# EAGLE schematic Automatic Changeover (EAGLE 9.6.2)
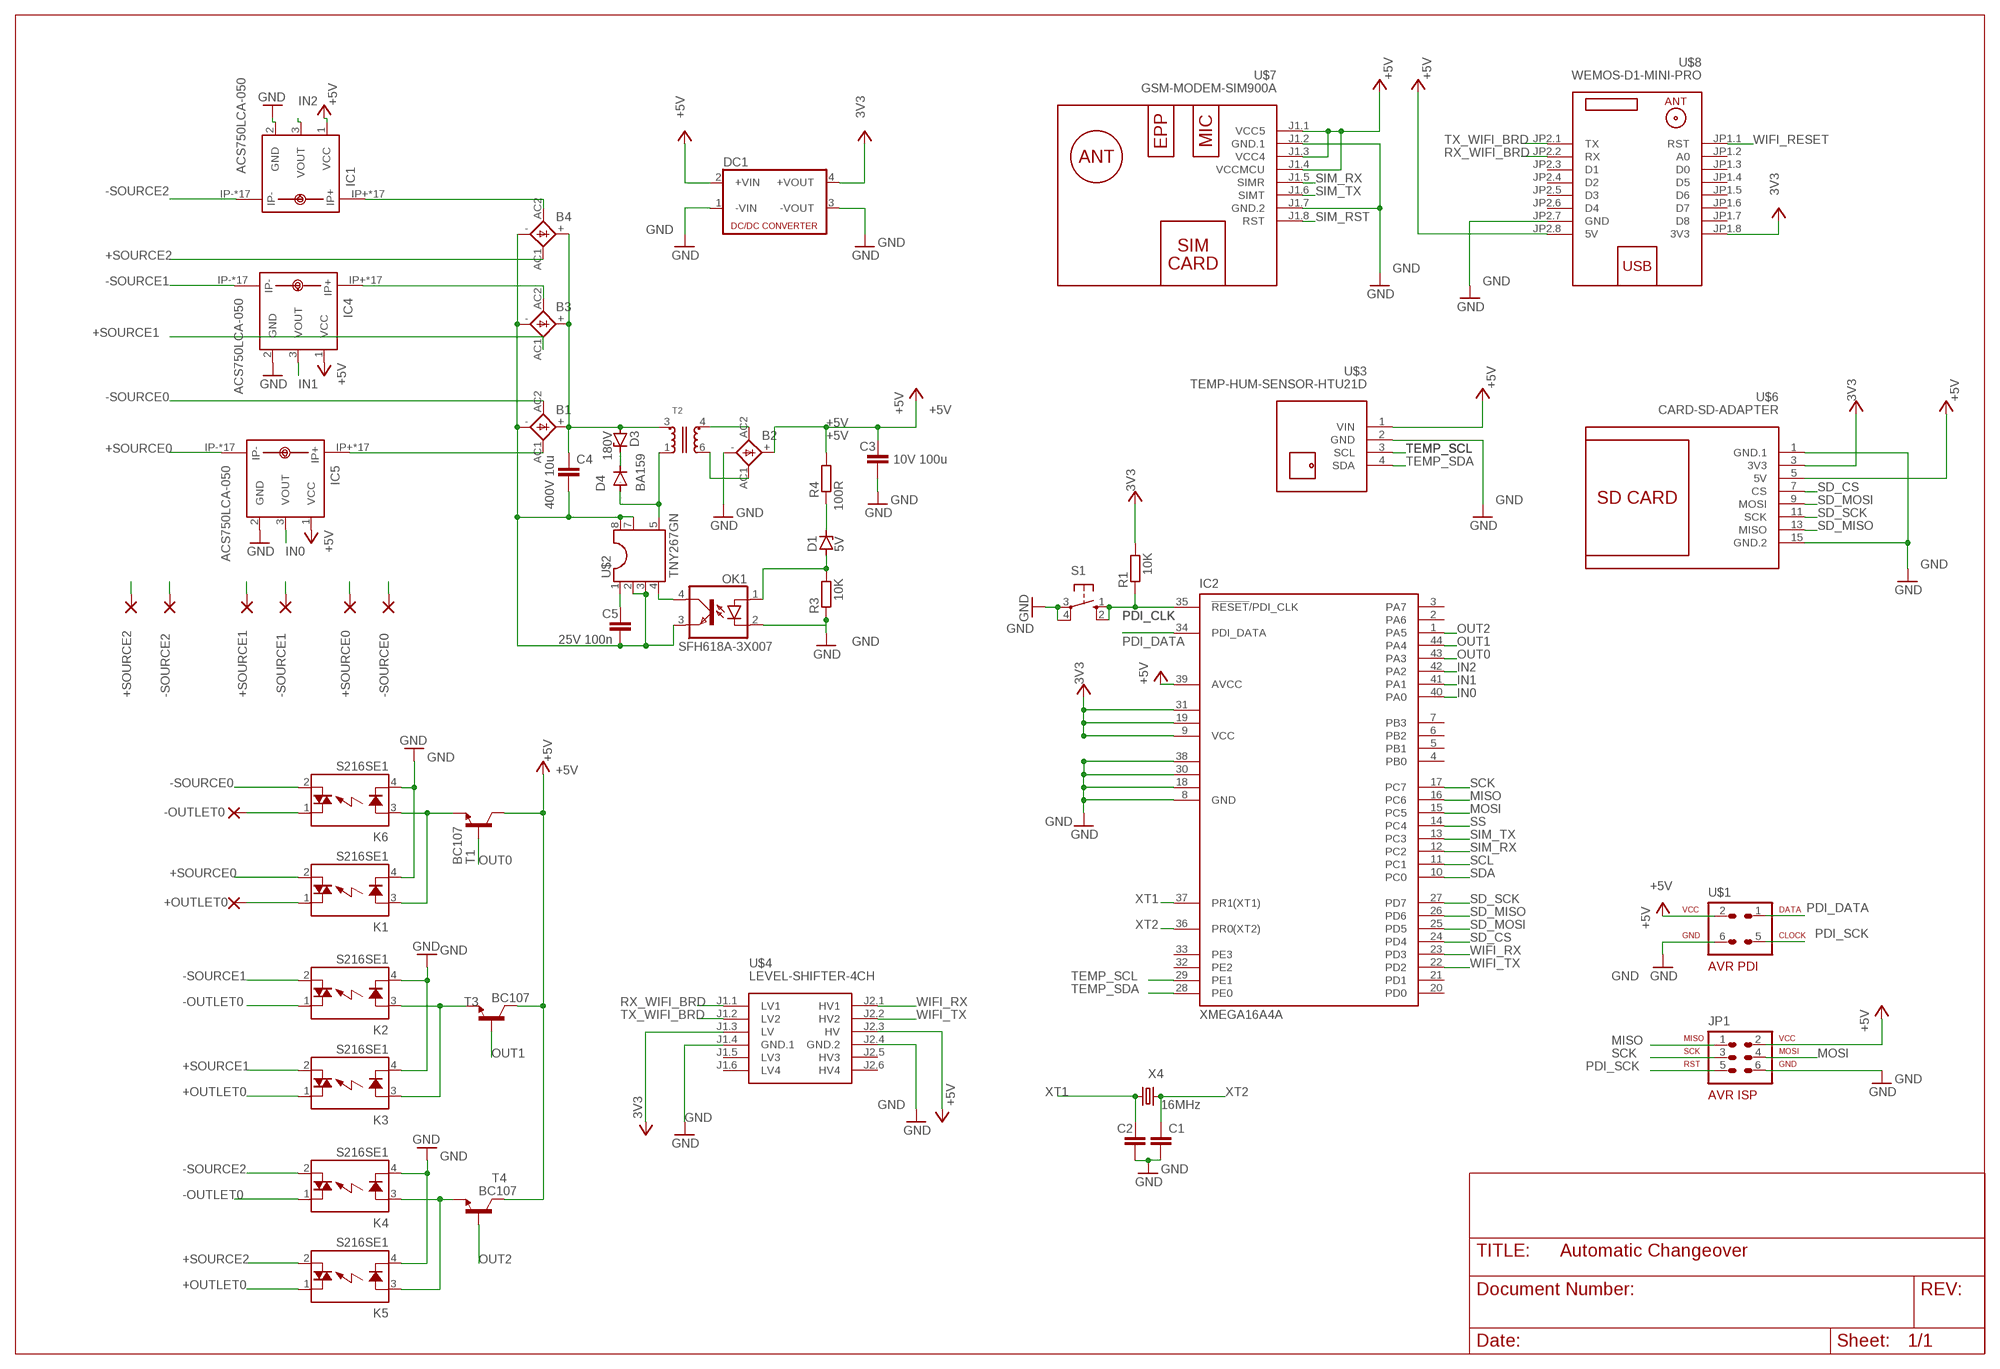
[diagram p0: schematic, sheet 1]

## Parts
+OUTLET0  3,81/1,4  [3,81/1,4]
+SOURCE0  3,81/1,4  [3,81/1,4]
+SOURCE1  3,81/1,4  [3,81/1,4]
+SOURCE2  3,81/1,4  [3,81/1,4]
-OUTLET0  3,81/1,4  [3,81/1,4]
-SOURCE0  3,81/1,4  [3,81/1,4]
-SOURCE1  3,81/1,4  [3,81/1,4]
-SOURCE2  3,81/1,4  [3,81/1,4]
B1  KBL  [KBL]
B2  KBL  [KBL]
B3  KBL  [KBL]
B4  KBL  [KBL]
C1  C-EU025-025X050  [C025-025X050]
C2  C-EU025-025X050  [C025-025X050]
C3  10V 100u  C2.5/2  [C2.5-2]
C4  400V 10u  C2.5/2  [C2.5-2]
C5  25V 100n  C2.5/2  [C2.5-2]
D1  5V  ZENER-DIODEP1-Z12  [P1Z12]
D3  180V  ZENER-DIODEP1-Z12  [P1Z12]
D4  BA159  1N4004  [DO41-10]
DC1  NME  [NME]
IC1  ACS750LCA-050  [ACS75050]
IC2  XMEGA16A4A  [TQFP44]
IC4  ACS750LCA-050  [ACS75050]
IC5  ACS750LCA-050  [ACS75050]
JP1  AVR-ISP-6VERT  [AVR-ISP-6]
K1  S216SE1  [S2XXEX]
K2  S216SE1  [S2XXEX]
K3  S216SE1  [S2XXEX]
K4  S216SE1  [S2XXEX]
K5  S216SE1  [S2XXEX]
K6  S216SE1  [S2XXEX]
OK1  SFH618A-3X007  [SMD4-7]
R1  10K  R-EU_R0805  [R0805]
R3  10K  R-EU_R0805  [R0805]
R4  100R  R-EU_R0805  [R0805]
S1  10-XX  [B3F-10XX]
T1  BC107  [TO18]
T2  WE-UNIT_74911810X  [WE_E13/7/4_THT_VERTIKAL_6PIN]
T3  BC107  [TO18]
T4  BC107  [TO18]
U$1  AVR-PDIVERT  [AVR-ISP-6]
U$2  TNY267GN  [SMD-8B]
U$3  TEMP-HUM-SENSOR-HTU21D  [TEMP-HUM-SENSOR-HTU21D]
U$4  LEVEL-SHIFTER-4CH  [LEVEL-SHIFTER-4CH]
U$6  CARD-SD-ADAPTER  [CARD-SD-ADAPTER]
U$7  GSM-MODEM-SIM900A  [GSM-MODEM-SIM900A]
U$8  WEMOS-D1-MINI-PRO  [WEMOS-D1-MINI-PRO]
X4  16MHz  CRYSTALS-NOGND-HC49/4H  [HC49]

## Nets
3V3: DC1.4(+VOUT) R1.2 U$6.3(3V3) U$8.JP1.8(3V3)
+5V: B2.+ C3.1 DC1.2(+VIN) IC1.1(VCC) IC2.39(AVCC) IC4.1(VCC) IC5.1(VCC) JP1.2 R4.2 T1.3(C) T3.3(C) T4.3(C) U$1.2 U$3.1(VIN) U$4.J2.3(HV) U$6.5(5V) U$7.J1.1(VCC5) U$7.J1.3(VCC4) U$7.J1.4(VCCMCU) U$8.JP2.8(5V)
+OUTLET0: K3.1(DS1) K5.1(DS1)
+SOURCE0: +SOURCE0.1(P) IC5.IP- IC5.IP-@2(IP-) IC5.IP-@3(IP-) IC5.IP-@4(IP-) IC5.IP-@5(IP-) IC5.IP-@6(IP-) IC5.IP-@7(IP-) IC5.IP-@8(IP-) IC5.IP-@9(IP-) IC5.IP-@10(IP-) IC5.IP-@11(IP-) IC5.IP-@12(IP-) IC5.IP-@13(IP-) IC5.IP-@14(IP-) IC5.IP-@15(IP-) IC5.IP-@16(IP-) IC5.IP-@17(IP-) K1.2(DS2)
+SOURCE1: +SOURCE1.1(P) B3.AC1(AC2) K3.2(DS2)
+SOURCE2: +SOURCE2.1(P) B4.AC1(AC2) K5.2(DS2)
-OUTLET0: K2.1(DS1) K4.1(DS1)
-SOURCE0: -SOURCE0.1(P) B1.AC2(AC1) K6.2(DS2)
-SOURCE1: -SOURCE1.1(P) IC4.IP- IC4.IP-@2(IP-) IC4.IP-@3(IP-) IC4.IP-@4(IP-) IC4.IP-@5(IP-) IC4.IP-@6(IP-) IC4.IP-@7(IP-) IC4.IP-@8(IP-) IC4.IP-@9(IP-) IC4.IP-@10(IP-) IC4.IP-@11(IP-) IC4.IP-@12(IP-) IC4.IP-@13(IP-) IC4.IP-@14(IP-) IC4.IP-@15(IP-) IC4.IP-@16(IP-) IC4.IP-@17(IP-) K2.2(DS2)
-SOURCE2: -SOURCE2.1(P) IC1.IP- IC1.IP-@2(IP-) IC1.IP-@3(IP-) IC1.IP-@4(IP-) IC1.IP-@5(IP-) IC1.IP-@6(IP-) IC1.IP-@7(IP-) IC1.IP-@8(IP-) IC1.IP-@9(IP-) IC1.IP-@10(IP-) IC1.IP-@11(IP-) IC1.IP-@12(IP-) IC1.IP-@13(IP-) IC1.IP-@14(IP-) IC1.IP-@15(IP-) IC1.IP-@16(IP-) IC1.IP-@17(IP-) K4.2(DS2)
GND: B2.- C1.2 C2.2 C3.2 DC1.1(-VIN) DC1.3(-VOUT) IC1.2(GND) IC2.8(GND) IC2.18(GND1) IC2.30(GND2) IC2.38(GND3) IC4.2(GND) IC5.2(GND) JP1.6 K1.4(K) K2.4(K) K3.4(K) K4.4(K) K5.4(K) K6.4(K) OK1.2(C) R3.1 S1.3(P) S1.4(P1) U$1.6 U$3.2(GND) U$4.J1.4(GND.1) U$4.J2.4(GND.2) U$6.1(GND.1) U$6.15(GND.2) U$7.J1.2(GND.1) U$7.J1.7(GND.2) U$8.JP2.7(GND)
IN0: IC2.40(PA0) IC5.3(VOUT)
IN1: IC2.41(PA1) IC4.3(VOUT)
IN2: IC1.3(VOUT) IC2.42(PA2)
MISO: IC2.16(PC6) JP1.1
MOSI: IC2.15(PC5) JP1.4
N$14: B4.AC2(AC1) IC1.IP+ IC1.IP+@2(IP+) IC1.IP+@3(IP+) IC1.IP+@4(IP+) IC1.IP+@5(IP+) IC1.IP+@6(IP+) IC1.IP+@7(IP+) IC1.IP+@8(IP+) IC1.IP+@9(IP+) IC1.IP+@10(IP+) IC1.IP+@11(IP+) IC1.IP+@12(IP+) IC1.IP+@13(IP+) IC1.IP+@14(IP+) IC1.IP+@15(IP+) IC1.IP+@16(IP+) IC1.IP+@17(IP+)
N$16: B1.AC1(AC2) IC5.IP+ IC5.IP+@2(IP+) IC5.IP+@3(IP+) IC5.IP+@4(IP+) IC5.IP+@5(IP+) IC5.IP+@6(IP+) IC5.IP+@7(IP+) IC5.IP+@8(IP+) IC5.IP+@9(IP+) IC5.IP+@10(IP+) IC5.IP+@11(IP+) IC5.IP+@12(IP+) IC5.IP+@13(IP+) IC5.IP+@14(IP+) IC5.IP+@15(IP+) IC5.IP+@16(IP+) IC5.IP+@17(IP+)
N$17: B1.+ B3.+ B4.+ C4.1 D3.A T2.3
N$20: B3.AC2(AC1) IC4.IP+ IC4.IP+@2(IP+) IC4.IP+@3(IP+) IC4.IP+@4(IP+) IC4.IP+@5(IP+) IC4.IP+@6(IP+) IC4.IP+@7(IP+) IC4.IP+@8(IP+) IC4.IP+@9(IP+) IC4.IP+@10(IP+) IC4.IP+@11(IP+) IC4.IP+@12(IP+) IC4.IP+@13(IP+) IC4.IP+@14(IP+) IC4.IP+@15(IP+) IC4.IP+@16(IP+) IC4.IP+@17(IP+)
N$32: -OUTLET0.1(P) K6.1(DS1)
N$36: D4.A T2.1 U$2.5(D)
N$38: B2.AC1(AC2) T2.6
N$39: D1.C R4.1
N$40: D1.A OK1.1(A) R3.2
N$41: B1.- B3.- B4.- C4.2 C5.2 OK1.3(EMIT) U$2.2(2GND) U$2.3(3GND) U$2.7(7HV-GND) U$2.8(8HV-GND)
N$42: B2.AC2(AC1) T2.4
N$43: D3.C D4.C
N$44: C5.1 U$2.1(BP)
N$45: OK1.4(COL) U$2.4(EN/UV)
N$47: +OUTLET0.1(P) K1.1(DS1)
N$58: K1.3(A) K6.3(A) T1.1(E)
N$61: K2.3(A) K3.3(A) T3.1(E)
N$63: K4.3(A) K5.3(A) T4.1(E)
OUT0: IC2.43(PA3) T1.2(B)
OUT1: IC2.44(PA4) T3.2(B)
OUT2: IC2.1(PA5) T4.2(B)
PDI_CLK: IC2.35(!RESET!/PDI_CLK) R1.1 S1.1(S) S1.2(S1)
PDI_DATA: IC2.34(PDI_DATA) U$1.1
PDI_SCK: JP1.5 U$1.5
RX_WIFI_BRD: U$4.J1.1(LV1) U$8.JP2.2(RX)
SCK: IC2.17(PC7) JP1.3
SCL: IC2.11(PC1)
SD_CS: IC2.24(PD4) U$6.7(CS)
SD_MISO: IC2.26(PD6) U$6.13(MISO)
SD_MOSI: IC2.25(PD5) U$6.9(MOSI)
SD_SCK: IC2.27(PD7) U$6.11(SCK)
SDA: IC2.10(PC0)
SIM_RST: U$7.J1.8(RST)
SIM_RX: IC2.12(PC2) U$7.J1.5(SIMR)
SIM_TX: IC2.13(PC3) U$7.J1.6(SIMT)
SS: IC2.14(PC4)
TEMP_SCL: IC2.29(PE1) U$3.3(SCL)
TEMP_SDA: IC2.28(PE0) U$3.4(SDA)
TX_WIFI_BRD: U$4.J1.2(LV2) U$8.JP2.1(TX)
VCC: IC2.9(VCC) IC2.19(VCC1) IC2.31(VCC2) U$4.J1.3(LV) ; supply symbol labelled 3V3
WIFI_RESET: U$8.JP1.1(RST)
WIFI_RX: IC2.23(PD3) U$4.J2.1(HV1)
WIFI_TX: IC2.22(PD2) U$4.J2.2(HV2)
XT1: C2.1 IC2.37(PR1(XT1)) X4.1
XT2: C1.1 IC2.36(PR0(XT2)) X4.2
Unconnected: IC2.2(PA6) IC2.3(PA7) IC2.4(PB0) IC2.5(PB1) IC2.6(PB2) IC2.7(PB3) IC2.20(PD0) IC2.21(PD1) IC2.32(PE2) IC2.33(PE3) U$4.J1.5(LV3) U$4.J1.6(LV4) U$4.J2.5(HV3) U$4.J2.6(HV4) U$8.JP1.2(A0) U$8.JP1.3(D0) U$8.JP1.4(D5) U$8.JP1.5(D6) U$8.JP1.6(D7) U$8.JP1.7(D8) U$8.JP2.3(D1) U$8.JP2.4(D2) U$8.JP2.5(D3) U$8.JP2.6(D4)

## Library data of the parts
+OUTLET0 +SOURCE0 +SOURCE1 +SOURCE2 -OUTLET0 -SOURCE0 -SOURCE1 -SOURCE2 = wirepad:3,81/1,4: THROUGH-HOLE PAD
B1-B4 = rectifier:KBL: DIOTEC RECTIFIER
C1 C2 = rcl:C-EU: CAPACITOR, European symbol; SPICEPREFIX: C
C3-C5 = capacitor-wima:C: CAPACITOR naming: grid - package width
D1 D3 = diode:ZENER-DIODE: Z-Diode
D4 = diode:1N4004: DIODE general purpose rectifier, 1 A
DC1 = dc-dc-converter:NME: DC-DC CONVERTER; MF: C & D TECHNOLOGIES, INC; MPN: NME1205D; OC_FARNELL: 1021466; OC_NEWARK: 98B8198
IC1 IC4 IC5 = allegro:ACS750*CA-050: Current Sensor display layer 49 Reference in BRD and place VIAs on circles Source: www.allegromicro.com/datafile/0750-050.pdf; MF: ALLEGRO MICROSYSTEMS, INC.; MPN: ACS750LCA-050; OC_FARNELL: 1457176; OC_NEWARK: 61H4464
IC2 = atmel:XMEGA16A4: MICROCONTROLLER Features High-performance, Low-power 8/16-bit AVR XMEGA Microcontroller Non-Volatile Program and Data Memories - 16 KB - 128 KB of In-System Self-Programmable Flash - 4 KB - 8 KB Boot Code Section with Independent Lock Bits - 1 KB - 2 KB EEPROM - 2 KB - 8 KB Internal SRAM Peripheral Features - Four-channel DMA Controller with support for external requests - Eight-channel Event System - Five 16-bit Timer/Counters Three Timer/Counters with 4 Output Compare or Input Capture channels Two Timer/Counters with 2 Output Compare or Input Capture channels High-Resolution Extensions on all Timer/Counters Advanced Waveform Extension on one Timer/Counter - Five USARTs IrDA Extension on one USART - Two Two-Wire Interfaces with dual address match (I2C and SMBus compatible) - Two SPIs (Serial Peripheral Interfaces) peripherals - AES and DES Crypto Engine - 16-bit Real Time Counter with Separate Oscillator - One Twelve-channel, 12-bit, 2 Msps Analog to Digital Converter - One Two-channel, 12-bit, 1 Msps Digital to Analog Converter - Two Analog Comparators with Window compare function - External Interrupts on all General Purpose I/O pins - Programmable Watchdog Timer with Separate On-chip Ultra Low Power Oscillator Special Microcontroller Features - Power-on Reset and Programmable Brown-out Detection - Internal and External Clock Options with PLL - Programmable Multi-level Interrupt Controller - Sleep Modes: Idle, Power-down, Standby, Power-save, Extended Standby - Advanced Programming, Test and Debugging Interfaces PDI (Program and Debug Interface) for programming, test and debugging I/O and Packages - 34 Programmable I/O Lines - 44 - lead TQFP - 44 - pad VQFN/QFN - 49 - ball VFBGA Operating Voltage - 1.6 - 3.6V Speed performance - 0 - 12 MHz @ 1.6 - 3.6V - 0 - 32 MHz @ 2.7 - 3.6V Drawn by Dipl.-Ing. (FH) Robert Siegler Created: 27.05.09; OC_FARNELL: unknown; OC_NEWARK: unknown
JP1 = avr-7:AVR-ISP-6: AVR ISP-6 Serial Programming Header
K1-K6 = relay:S2*: SIP Type SSR for Medium Power Control SHARP Source: 168149-da-01-en-Solid_State_Relais_S_202_SE1_SE2.pdf; OC_FARNELL: unknown; OC_NEWARK: unknown
OK1 = optocoupler:SFH618?*: Optocoupler, Phototransistor Output, Low Input Current Source: Data sheet <http://www.vishay.com/docs/83673/sfh618.pdf>; OC_FARNELL: unknown; OC_NEWARK: unknown
R1 R3 R4 = rcl:R-EU_: RESISTOR, European symbol; SPICEPREFIX: R
S1 = switch-omron:10-XX: OMRON SWITCH; MPN: B3F-1000; OC_FARNELL: 176432; OC_NEWARK: 36M3542
T1 T3 T4 = transistor:BC107: NPN TRANSISTOR
T2 = Wurth_Elektronik_Passive_rev16b:WE-UNIT_74911810X: WE-UNIT Off-Line Transformer Characteristics Nominal input voltage: 125–375 VDC (85–265 VAC) Output power 3 W and 9 W Operating temperature: –40 °C to +125 °C Clearance and creepage distance 6 mm min. Insulation test voltage: 4 kVAC, 1 Minute Design compliant to EN 61558-2-16: reinforced insulation; except 749 118 10 xx: Basic insulation Applications Designed for Tiny Switch ICs from Power Integration and NCP101x or 105x of ON Semiconductor For SMPS with universal input from 85 VAC up to 265 VAC <http://katalog.we-online.de/media/images/eisos/UtUNIT_MID_pf2.jpg> Details see: http://katalog.we-online.de/en/pbs/WE-UNIT?m Updated by Dan Xu 2014-07-11 2014 (C) Wurth Elektronik
U$1 = avr-7:AVR-PDI: AVR PDI programming interface connector
U$2 = tny26x_27x:TNY267GN
U$3 = diy-modules:TEMP-HUM-SENSOR-HTU21D: Digital Humidity & Temperature Sensor based on HTU21D device More information about HTU21D device is available here: http://futureeverything.org/wp-content/uploads/2014/05/Humidity-Datasheet.pdf HTU21D Arudino Library is available here: https://learn.sparkfun.com/tutorials/htu21d-humidity-sensor-hookup-guide/htu21d-library-and-functions Click here to find device on ebay.com <http://www.ebay.com/sch/htu21d+board>
U$4 = diy-modules:LEVEL-SHIFTER-4CH: 4-Channel Bi-Directional Logic Level Converter based on BSS128 transistors Click here to find device on ebay.com <http://www.ebay.com/sch/i2c+logic+converter+module>
U$6 = diy-modules:CARD-SD-ADAPTER: Full Size SD Card Adapter Module with onboard 3.3V regulator Guide describing how to use SD card with Arduino is available here: https://www.arduino.cc/en/Reference/SDCardNotes Click here to find device on ebay.com <http://www.ebay.com/sch/sd+card+socket+module>
U$7 = diy-modules:GSM-MODEM-SIM900A: GSM Mini Module based on SIM900A Schematic available here: http://www.electrodragon.com/w/SIM900_(SIM900A)_Mini_DEV_Board
U$8 = diy-modules:WEMOS-D1-MINI-PRO: WEMOS D1 mini Pro: Mini Wi-Fi Board based on ESP-8266EX chip More details can be found here: https://www.wemos.cc/product/d1-mini-pro.html Click here to find device on ebay.com <http://www.ebay.com/sch/wemos+d1+mini+pro>
X4 = IQD-Frequency-Products:CRYSTALS-NOGND: CRYSTALS CAN NOT GROUNDED

## Net classes
0 default: width 0.203 mm, drill 0.203 mm, clearance 0.152 mm